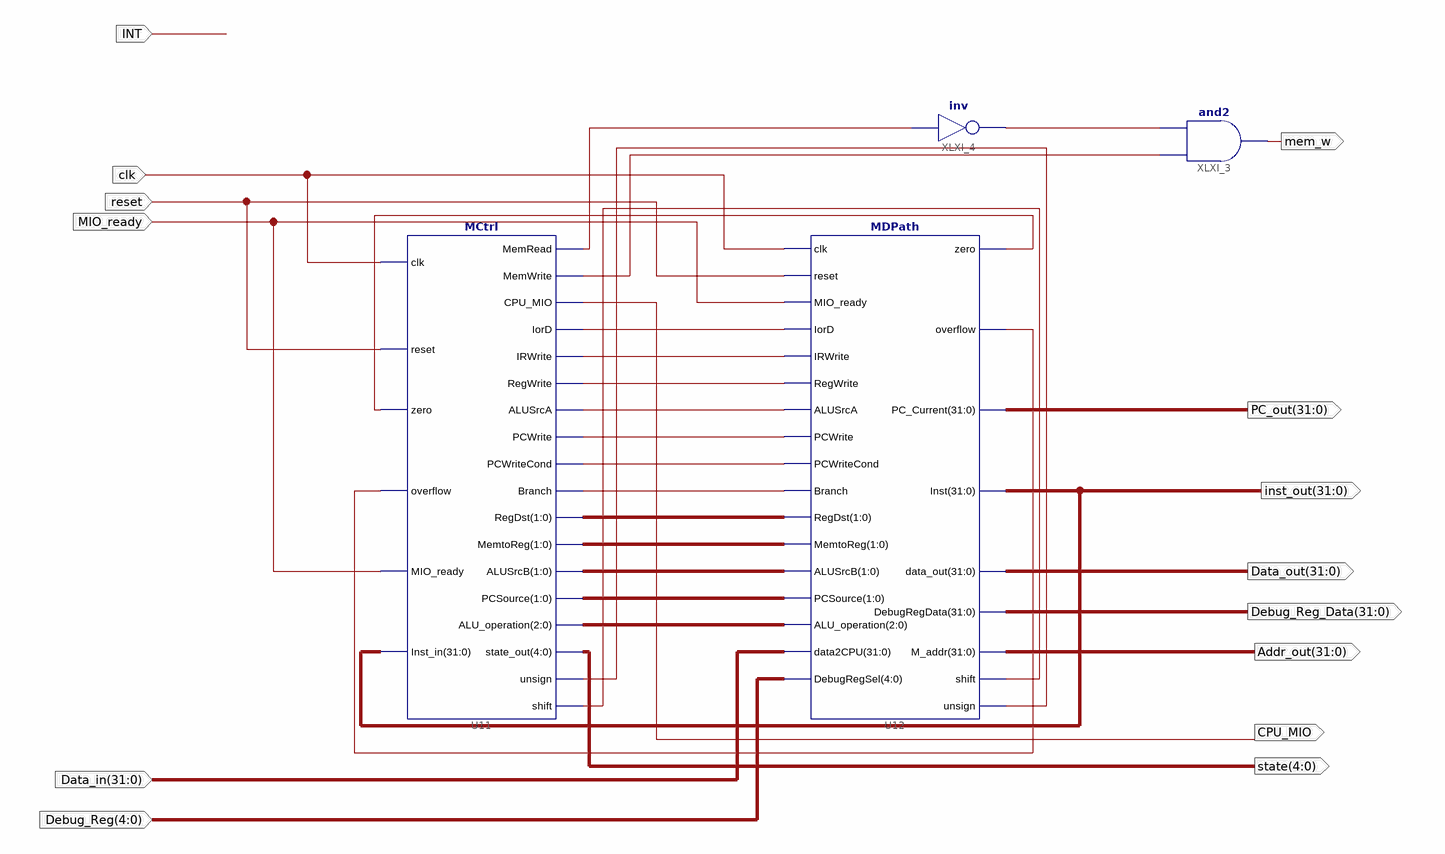
[diagram p0: schematic sheet 1]
// Xilinx ISE schematic MCPU.sch (kintex7) as structural Verilog: 4 symbols, 14 ports
module MCPU (
  input  [31:0] Data_in,
  input  clk,
  input  reset,
  input  MIO_ready,
  input  INT,
  input  [4:0] Debug_Reg,
  output CPU_MIO,
  output [4:0] state,
  output mem_w,
  output [31:0] inst_out,
  output [31:0] PC_out,
  output [31:0] Data_out,
  output [31:0] Addr_out,
  output [31:0] Debug_Reg_Data
);

  wire XLXN_1, XLXN_2, XLXN_3, XLXN_4, XLXN_5, XLXN_6, XLXN_7, XLXN_22, XLXN_31, XLXN_32, XLXN_39, XLXN_40,
       XLXN_41, XLXN_42;
  wire [1:0] XLXN_8, XLXN_9, XLXN_10, XLXN_11;
  wire [2:0] XLXN_12;

  MDPath U12 (
    .clk(clk), .reset(reset), .MIO_ready(MIO_ready), .IorD(XLXN_1), .IRWrite(XLXN_2), .RegWrite(XLXN_3),
    .ALUSrcA(XLXN_4), .PCWrite(XLXN_7), .PCWriteCond(XLXN_6), .Branch(XLXN_5), .RegDst(XLXN_8),
    .MemtoReg(XLXN_9), .ALUSrcB(XLXN_10), .PCSource(XLXN_11), .ALU_operation(XLXN_12), .data2CPU(Data_in),
    .shift(XLXN_41), .unsign(XLXN_40), .zero(XLXN_42), .overflow(XLXN_22), .PC_Current(PC_out),
    .Inst(inst_out), .data_out(Data_out), .M_addr(Addr_out), .DebugRegSel(Debug_Reg),
    .DebugRegData(Debug_Reg_Data));
  MCtrl U11 (
    .clk(clk), .reset(reset), .zero(XLXN_42), .overflow(XLXN_22), .MIO_ready(MIO_ready), .Inst_in(inst_out),
    .MemRead(XLXN_31), .MemWrite(XLXN_32), .CPU_MIO(CPU_MIO), .IorD(XLXN_1), .IRWrite(XLXN_2),
    .RegWrite(XLXN_3), .ALUSrcA(XLXN_4), .PCWrite(XLXN_7), .PCWriteCond(XLXN_6), .unsign(XLXN_40),
    .shift(XLXN_41), .Branch(XLXN_5), .ALU_operation(XLXN_12), .state_out(state), .RegDst(XLXN_8),
    .MemtoReg(XLXN_9), .ALUSrcB(XLXN_10), .PCSource(XLXN_11));
  and XLXI_3 (mem_w, XLXN_32, XLXN_39);
  not XLXI_4 (XLXN_39, XLXN_31);
endmodule
